# EasyEDA Pro project ProPrj_Microros_esp32_2025-06-17.epro, schematic Power_test
Create Date: 2024-04-07; Page Name: P1; Project Name: Microros_esp32; Schematic Name: Schematic2; Update Date: 2024-04-07; Company: 嘉立创EDA; Page Size: A4; Version: V1.0
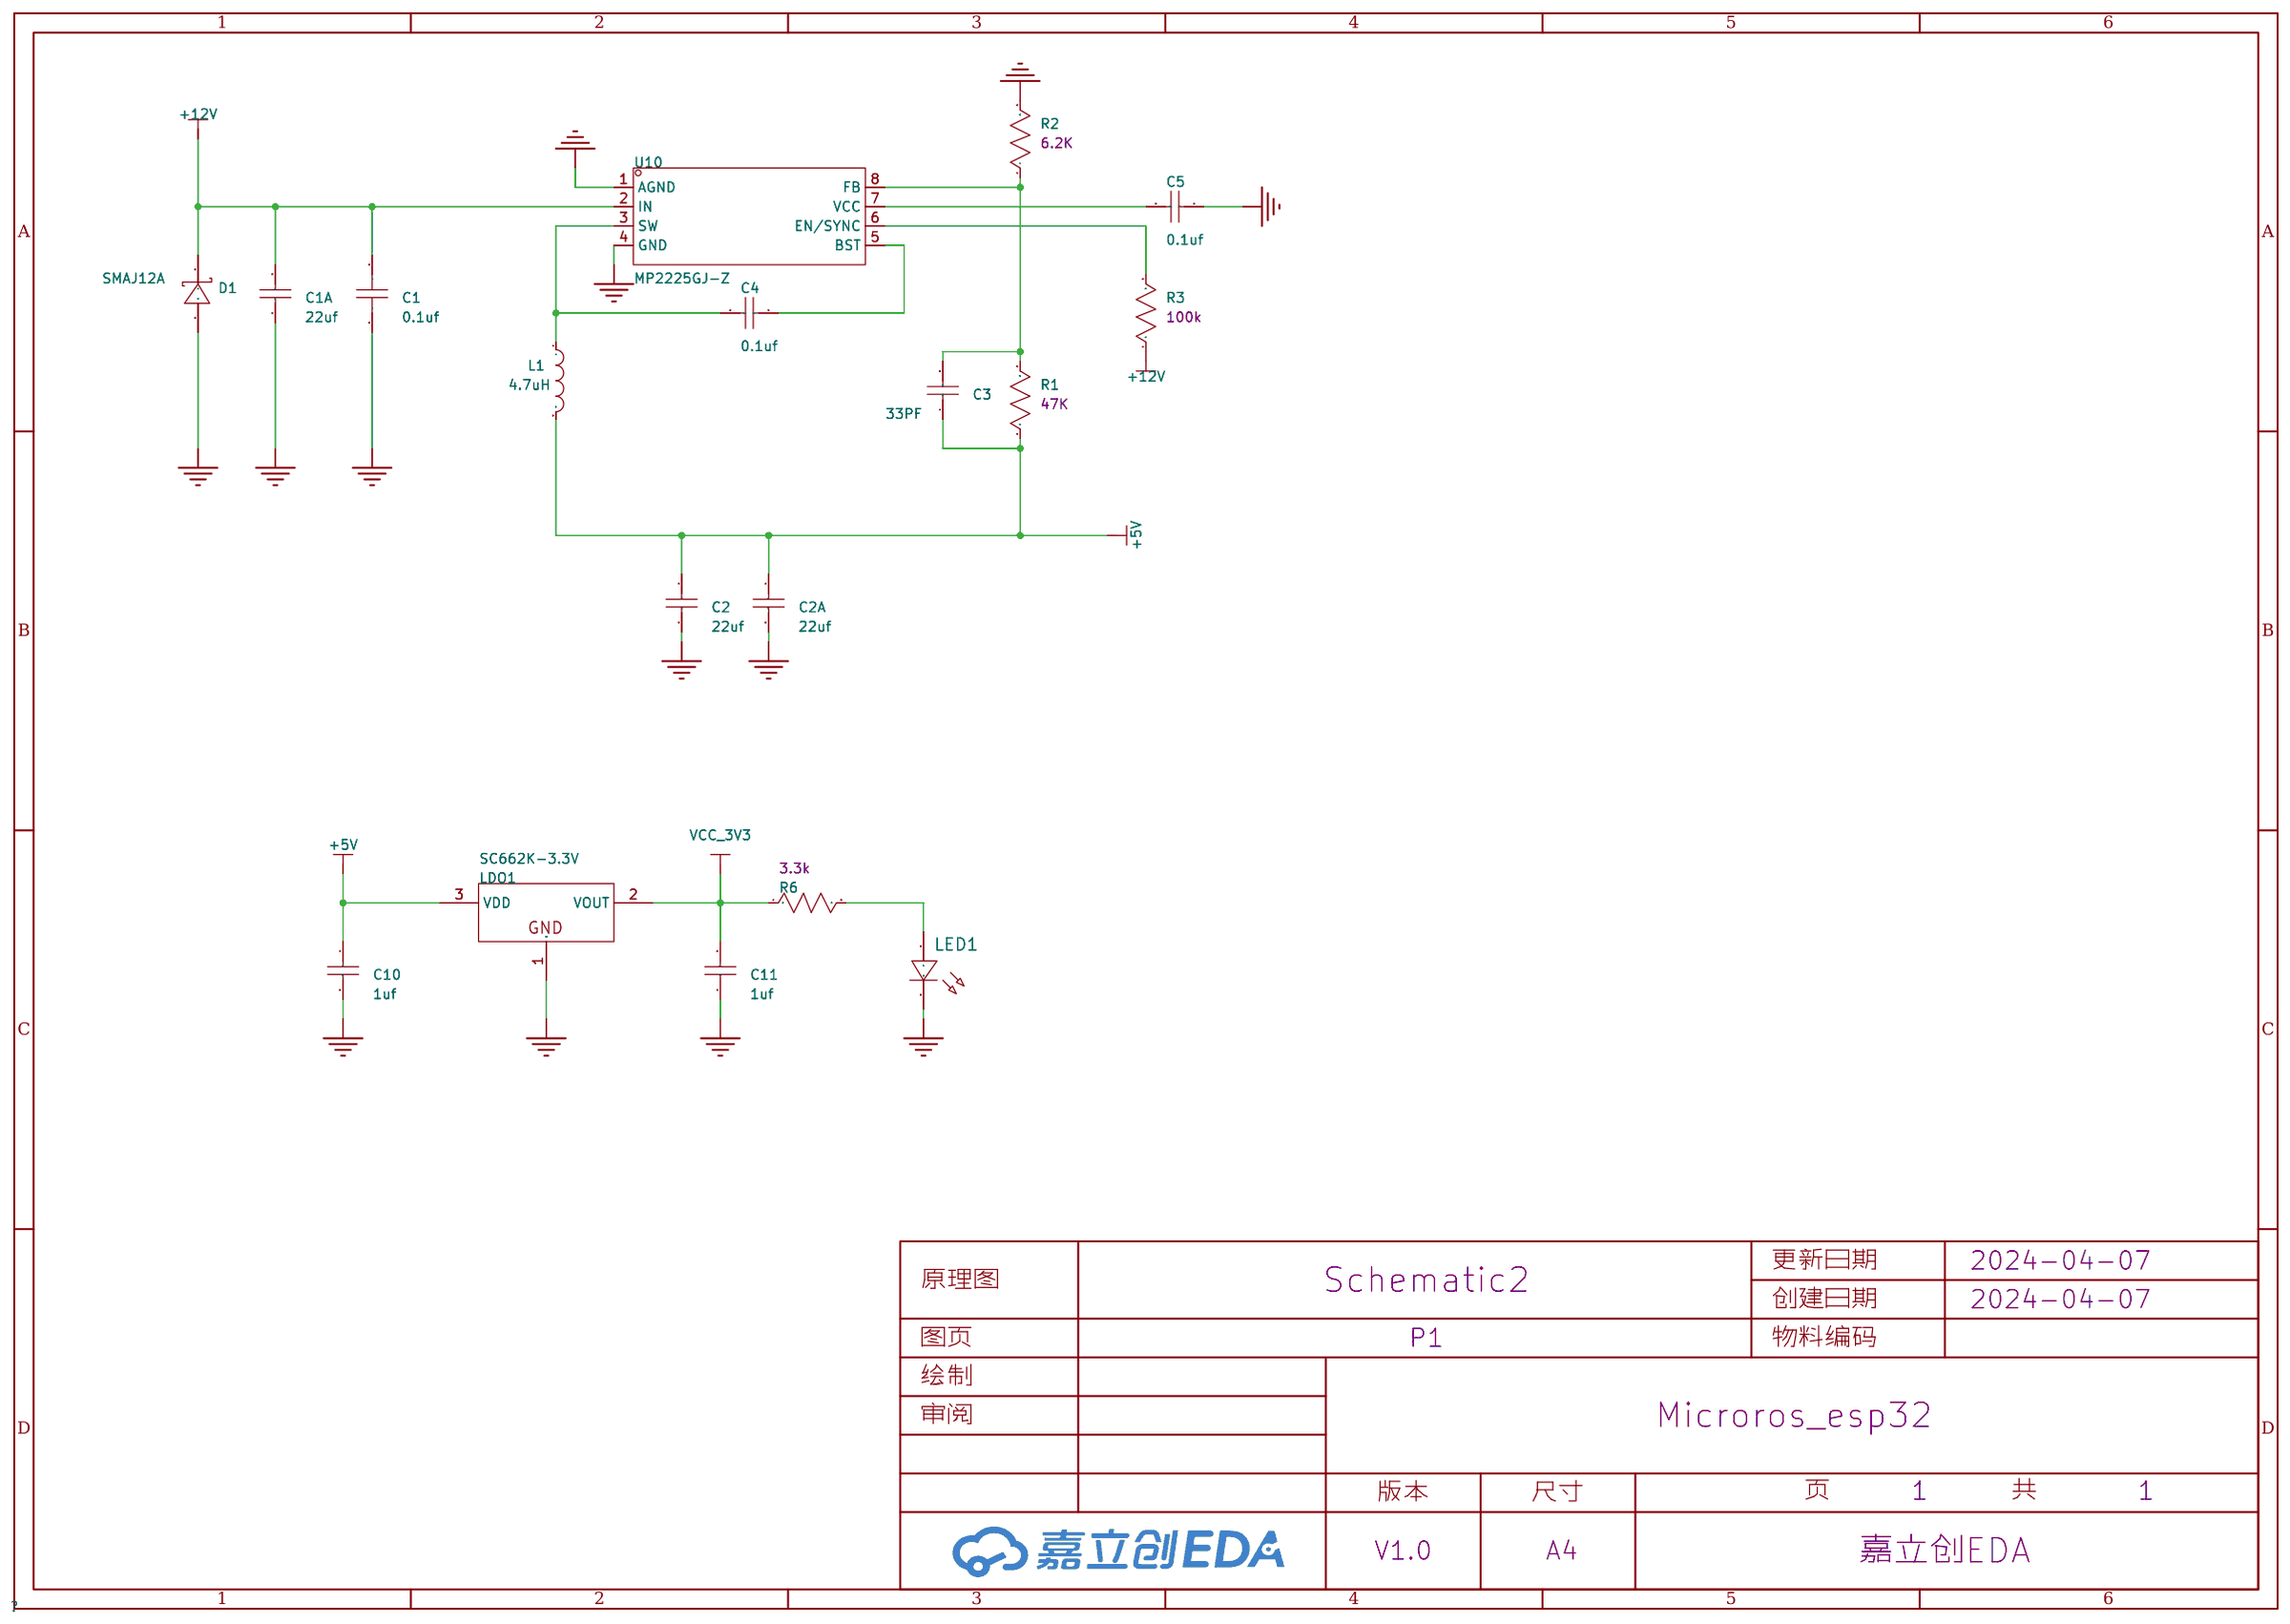
[diagram p0: schematic sheet]

## Parts
C1  0.1uf  [C0603]
C1A  22uf  [C1206]
C2  22uf  [C1206]
C2A  22uf  [C1206]
C3  33PF  [C0603]
C4  0.1uf  [C0603]
C5  0.1uf  [C0603]
C10  1uf  [C0603]
C11  1uf  [C0603]
D1  SMAJ12A  [SMA_L4.3-W2.8-LS5.1-RD]
L1  4.7uH  [IND-SMD_L6.5-W6.0_GPSR0630]
LDO1  SC662K-3.3V  [SOT-23-3_L2.9-W1.3-P1.90-LS2.4-BR]
LED1  -  [LED_0603]
R1  -  [R0603]
R2  -  [R0603]
R3  -  [R0603]
R6  -  [R0603]
U10  MP2225GJ-Z  [TSOT-23-8_L2.9-W1.6-P0.65-LS2.8-BR]

## Library data of the parts
C1 = CAP_0603: Supplier Footprint: 0603
C1A C2 C2A C3-C5 C10 C11 = 1206B102K202NT: 容值:1nF;精度:±10%;额定电压:2kV;材质(温度系数):X7R;; LCSC Part Name: 1nF ±10% 2kV; Supplier Part: C9196; Manufacturer: FH(风华); Supplier Footprint: 1206; JLCPCB Part Class: 基础库; Datasheet: https://atta.szlcsc.com/upload/public/pdf/source/20200305/C486355_26A10D38EF8C2A5C37091D0039909270.pdf; Supplier: LCSC; Tolerance: ±10%; Voltage Rated: 2kV; Temperature Coefficient: X7R
D1 = SMAJ12A: 反向截止电压(Vrwm):12V;最大钳位电压:19.9V;峰值脉冲电流(Ipp)@10/1000us:20.1A;击穿电压:13.3V;; LCSC Part Name: 单向TVS 12V截止 20.1A峰值脉冲; Supplier Part: C356741; Manufacturer: JJW(捷捷微); Supplier Footprint: SMA(DO-214AC); JLCPCB Part Class: 扩展库; Datasheet: https://atta.szlcsc.com/upload/public/pdf/source/20190118/C364660_B64EB57815AD6306F3CC88F8ECD7A3CF.pdf; Supplier: LCSC; Reverse Stand-Off Voltage (Vrwm): 12V; Maximum Clamping Voltage: 19.9V; Peak Pulse Current (Ipp)@10/1000us: 20.1A; Breakdown Voltage: 13.3V; Type: TVS
L1 = GPSR0630-3R3M: 电感值:3.3uH;精度:±20%;额定电流:5A;; LCSC Part Name: 3.3uH ±20%; Supplier Part: C477238; Manufacturer: Gantong(感通); Supplier Footprint: SMD; JLCPCB Part Class: 扩展库; Datasheet: https://atta.szlcsc.com/upload/public/pdf/source/20200331/C477236_832C068A9BF5320A61F8C7EAA1B09F78.pdf; Supplier: LCSC; Tolerance: ±20%; Rated Current: 5A; DC Resistance (DCR): 32mΩ
LDO1 = SC662K-3.3V: 输出类型:固定;最大输入电压:6V;输出电压:3.3V;最大输出电流:250mA;电源纹波抑制比(PSRR):50dB@(1kHz);输出极性:正极;; LCSC Part Name: 输入6V 输出3.3V 250mA 停产 停产; Supplier Part: C83932; Manufacturer: FM(富满); Supplier Footprint: SOT-23; JLCPCB Part Class: 扩展库; Datasheet: https://atta.szlcsc.com/upload/public/pdf/source/20161024/1477288576049.pdf; Supplier: LCSC; Output Type: 固定; Maximum Input Voltage: 6V; Output Voltage: 3.3V; MAX Output Current: 250mA; Power Supply Rejection Ratio (PSRR): 50dB@(1kHz); Dropout Voltage: 38mV@(10mA); Output Polarity: 正极; Number of Outputs: 1
LED1 = LED_0603-R: Supplier Footprint: 0603
R1 = R_0603_US: Value(Ω): 47K
R2 = R_0603_US: Value(Ω): 6.2K
R3 = R_0603_US: Value(Ω): 100k
R6 = R_0603_US: Value(Ω): 3.3k
U10 = MP2225GJ-Z_C133066: 功能类型:降压型;输出类型:可调;输入电压:4.5V~18V;输出电压:600mV~17V;输出电流(最大值):5A;; Supplier Part: C133066; Manufacturer: MPS; Supplier Footprint: TSOT-23-8; JLCPCB Part Class: 扩展库; Datasheet: https://atta.szlcsc.com/upload/public/pdf/source/20240315/DE01001F1E5BE5D21C887012CE3070B7.pdf; Supplier: LCSC; Function: 降压型; Output Type: 可调; Input Voltage: 4.5V~18V; Output Voltage: 600mV~17V; Output Current (Max): 5A; Switching Frequency: 500kHz; Operating Temperature: -40℃~+125℃@(TJ); Synchronous Rectification: 是; Number of Outputs: 1; Topology: 降压式; Switch tube (built-in/external): 内置

## Nets
+5V: C2.2 C2A.1 C3.1 C10.1 L1.2 LDO1.3(VDD) R1.1
+12V: C1.2 C1A.2 D1.1(K) R3.1 U10.2(IN)
GND: C1.1 C1A.1 C2.1 C2A.2 C5.1 C10.2 C11.1 D1.2(A) LDO1.1(GND) LED1.1(C) R2.2 U10.1(AGND) U10.4(GND)
VCC_3V3: C11.2 LDO1.2(VOUT) R6.1
$1N931: C5.2 U10.7(VCC)
$1N1050: R3.2 U10.6(EN/SYNC)
$1N1174: C4.2 L1.1 U10.3(SW)
$1N1183: C4.1 U10.5(BST)
$1N1509: C3.2 R1.2 R2.1 U10.8(FB)
$1N1839: LED1.2(A) R6.2
